# EAGLE schematic urdevboard (EAGLE 5.06), part 2 of 2
## Sheet 16 of 16
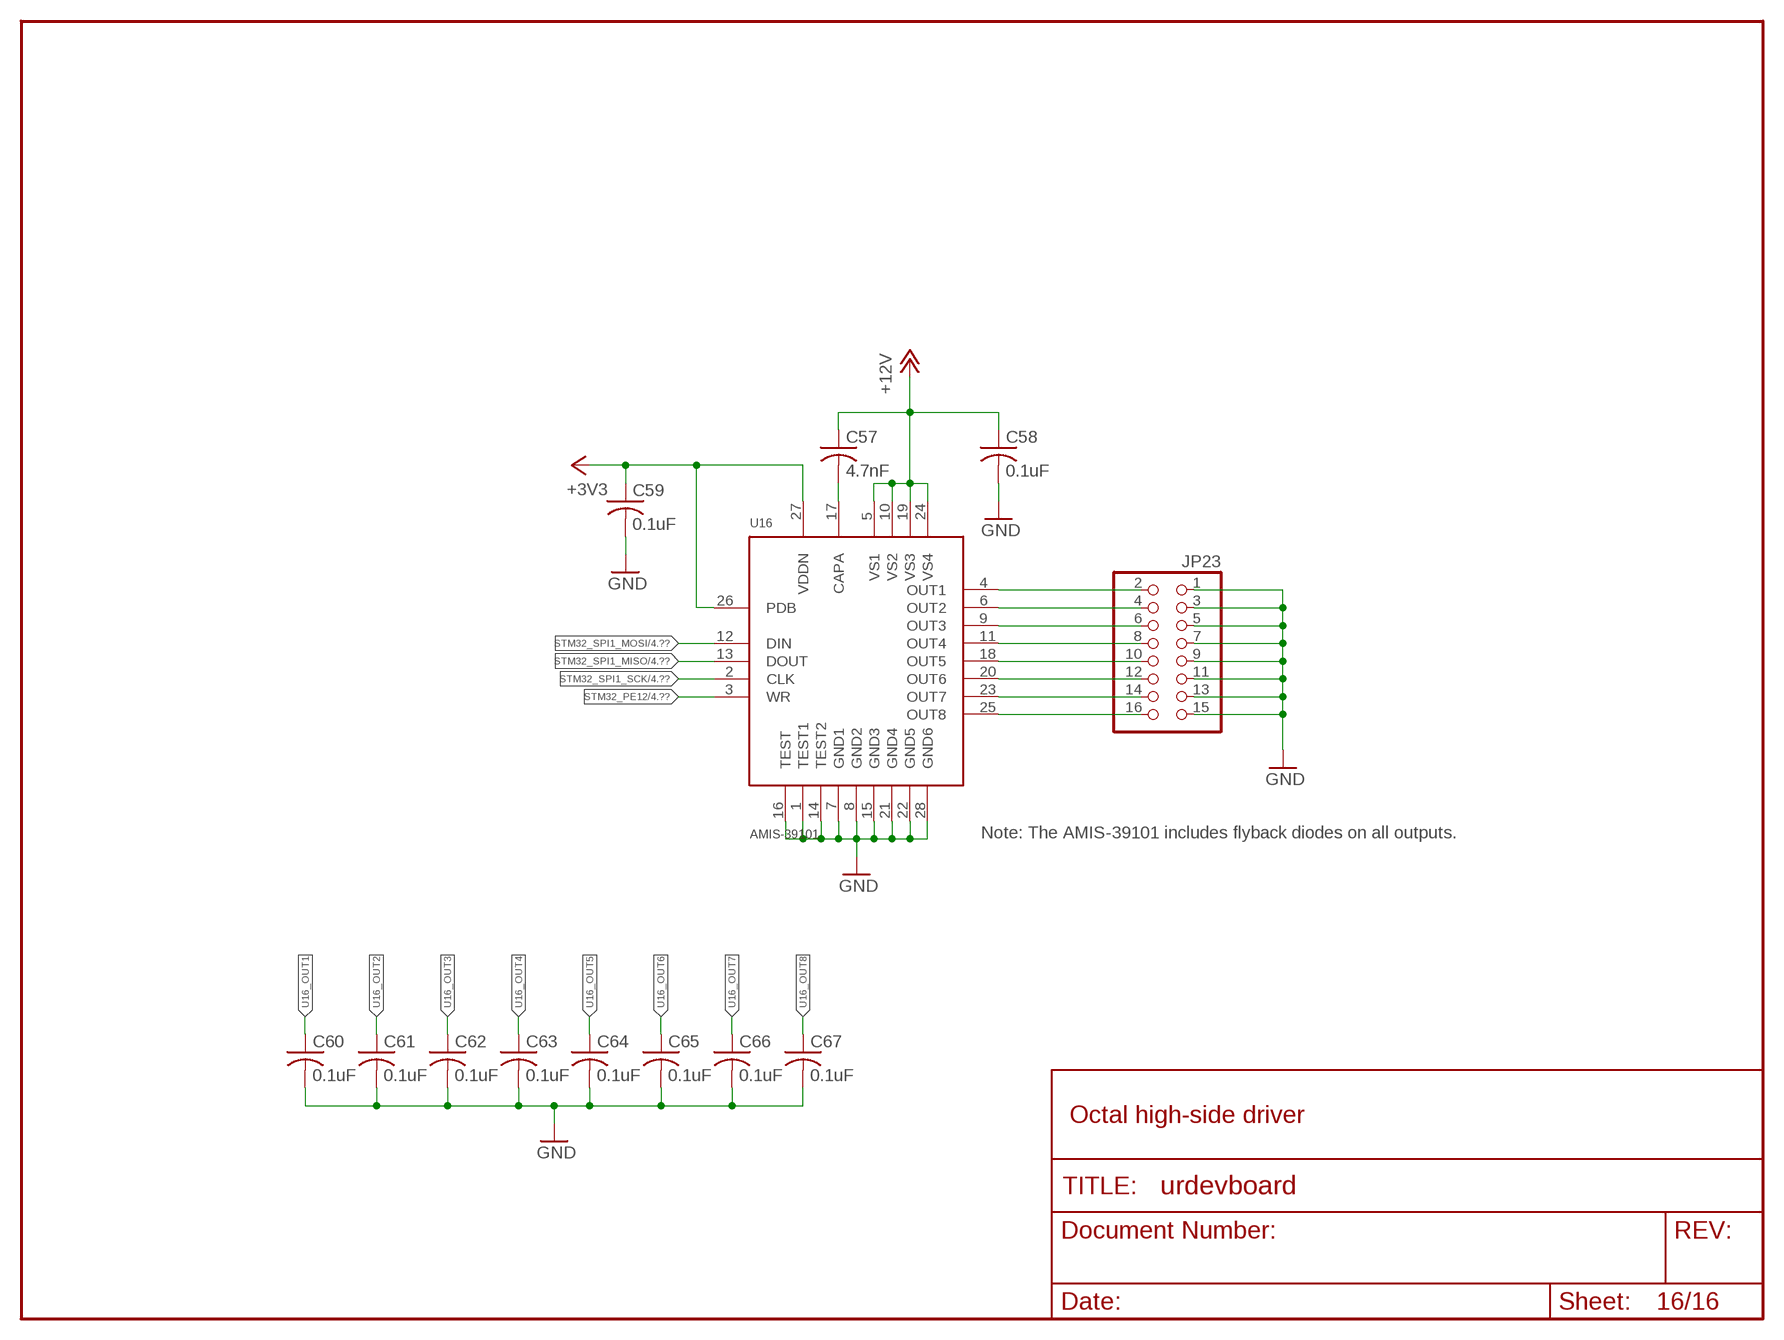
[diagram p15: schematic, sheet 16]

### Parts
C57  4.7nF  C-USC0402  [C0402]
C58  0.1uF  C-USC0402  [C0402]
C59  0.1uF  C-USC0402  [C0402]
C60  0.1uF  C-USC0402  [C0402]
C61  0.1uF  C-USC0402  [C0402]
C62  0.1uF  C-USC0402  [C0402]
C63  0.1uF  C-USC0402  [C0402]
C64  0.1uF  C-USC0402  [C0402]
C65  0.1uF  C-USC0402  [C0402]
C66  0.1uF  C-USC0402  [C0402]
C67  0.1uF  C-USC0402  [C0402]
JP23  PINHD-2X8  [2X08]
U16  AMIS-39101  [SO-28W]

### Nets
+3V3: C59.1 U16.26(PDB) U16.27(VDDN) ; also sheet 1,2,3,4,5,6,7,8,9,10,11
+12V: C57.1 C58.1 U16.5(VS1) U16.10(VS2) U16.19(VS3) U16.24(VS4) ; also sheet 7,8,13,14,15
GND: C58.2 C59.2 C60.2 C61.2 C62.2 C63.2 C64.2 C65.2 C66.2 C67.2 JP23.1 JP23.3 JP23.5 JP23.7 JP23.9 JP23.11 JP23.13 JP23.15 U16.1(TEST1) U16.7(GND1) U16.8(GND2) U16.14(TEST2) U16.15(GND3) U16.16(TEST) U16.21(GND4) U16.22(GND5) U16.28(GND6) ; also sheet 1,2,3,4,5,6,7,8,9,10,11,12,13,14,15
STM32_PE12: U16.3(WR) ; also sheet 4
STM32_SPI1_MISO: U16.13(DOUT) ; also sheet 4
STM32_SPI1_MOSI: U16.12(DIN) ; also sheet 4
STM32_SPI1_SCK: U16.2(CLK) ; also sheet 4
U16_CAPA: C57.2 U16.17(CAPA)
U16_OUT1: C60.1 JP23.2 U16.4(OUT1)
U16_OUT2: C61.1 JP23.4 U16.6(OUT2)
U16_OUT3: C62.1 JP23.6 U16.9(OUT3)
U16_OUT4: C63.1 JP23.8 U16.11(OUT4)
U16_OUT5: C64.1 JP23.10 U16.18(OUT5)
U16_OUT6: C65.1 JP23.12 U16.20(OUT6)
U16_OUT7: C66.1 JP23.14 U16.23(OUT7)
U16_OUT8: C67.1 JP23.16 U16.25(OUT8)

### Notes on the sheet
- Note: The AMIS-39101 includes flyback diodes on all outputs.
- Octal high-side driver

## Power pins joined to a net without a drawn wire
VDD: U3.6(VLCD:VDD)

## Library data of the parts
BAT1 = battery:CBC3: Intelligent Thin Film Battery With integrated power management
C1-C14 C17-C31 C33 C35 C36 C38-C43 C45-C49 C54-C118 = rcl:C-US: CAPACITOR, American symbol
C15 C16 C34 C50-C53 = SparkFun:CAP: Capacitor Standard 0603 ceramic capacitor, and 0.1" leaded capacitor.
C32 C37 C44 = rcl:CPOL-US: POLARIZED CAPACITOR, American symbol
D1-D24 D26-D35 = diode:SCHOTTKY-DIODE: Schottky Diode
D25 = diode:SCHOTTKY-3: Schottky Diode
D36 = diode:DIODE_SCHOTTKY2-: Schottky Bidirectional Diode
F1-F3 = SparkFun:PTC: Resettable Fuse PTC Resettable Fuse. Spark Fun Electronics SKU : COM-08357
IC1 IC2 = st-microelectronics:VNH2SP30: FULLY INTEGRATED H-BRIDGE MOTOR DRIVER Source: http://pdf1.alldatasheet.com/datasheet-pdf/view/84563/STMICROELECTRONICS/VNH2SP30.html
IC3 = SparkFun:L298: L298 Dual Full Bridge Driver
IC4 IC5 = 74xx-little-us:74*1G3157: Single-Pole, Double-Throw Analog Switch Source: http://focus.ti.com/lit/ds/symlink/sn74lvc1g3157.pdf
IC6 = microchip:93-*: Serial EEPROM 512 x 8 bit/256 x 16 bit/1 K/4 K, 5.0 V, Microwire
IC7 = 74xx-us:74*164: 8-bit parallel out SHIFT REGISTER
IC8 = on-semiconductor:LV8549M: 12V Stepper Motor Driver Source: http://www.onsemi.com/pub_link/Collateral/LV8549M-D.PDF Author: jbaker0428@gmail.com
IC9 = 74xx-little-us:74*2G17: Low-power dual Schmitt trigger
J1 = con-amphenol:ESPM02200
J2-J5 = con-tyco:796689-2: TERMINAL BLOCK 5 mm, Euro Style
J6 = con-sullinselectronics:RJ45: RJ-45 Connector
JARD = SparkFun:ARDUINO_SHIELD
JP1 = pinhead:PINHD-2X10: PIN HEADER
JP2 = pinhead:PINHD-2X11: PIN HEADER
JP3-JP5 = pinhead:PINHD-2X6: PIN HEADER
JP6-JP12 JP14-JP20 = SparkFun:M03: Header 3 Standard 3-pin 0.1" header. Use with straight break away headers (SKU : PRT-00116), right angle break away headers (PRT-00553), swiss pins (PRT-00743), machine pins (PRT-00117), and female headers (PRT-00115). Molex polarized connector foot print use with SKU : PRT-08232 with associated crimp pins and housings.
JP13 = SparkFun:M05X2: Header 5x2 Standard 10-pin dual row 0.1" header. Commonly used with AVR-ISP. Use with Spark Fun Electronics SKU: PRT-00778
JP21 = SparkFun:M02: Header 2 Standard 2-pin 0.1" header. Use with straight break away headers (SKU : PRT-00116), right angle break away headers (PRT-00553), swiss pins (PRT-00743), machine pins (PRT-00117), and female headers (PRT-00115). Molex polarized connector foot print use with SKU : PRT-08233 with associated crimp pins and housings.
JP22 = pinhead:PINHD-2X5: PIN HEADER
JP23 = pinhead:PINHD-2X8: PIN HEADER
JP24-JP27 = SparkFun:M05: Header 5 Standard 5-pin 0.1" header. Use with straight break away headers (SKU : PRT-00116), right angle break away headers (PRT-00553), swiss pins (PRT-00743), machine pins (PRT-00117), and female headers (PRT-00115). Molex polarized connector foot print use with SKU : PRT-08230 with associated crimp pins and housings.
JP28 = SparkFun:M04: Header 4 Standard 4-pin 0.1" header. Use with straight break away headers (SKU : PRT-00116), right angle break away headers (PRT-00553), swiss pins (PRT-00743), machine pins (PRT-00117), and female headers (PRT-00115). Molex polarized connector foot print use with SKU : PRT-08231 with associated crimp pins and housings. 1MM SMD Version SKU: PRT-10208
JP29-JP31 = SparkFun:FIDUCIAL: Fiducial Alignment Points Various fiducial points for machine vision alignment.
L1-L4 = rcl:L-US: INDUCTOR, American symbol
L5 = wuerth-elektronik:WE-CBF: SMD EMI Suppression Ferrite Beads - excellent anti-EMI properties - low DCR - impedances till 3000 ohms - rated current up to 6 A
LED1-LED8 = led:LED: LED OSRAM: - CHIPLED LG R971, LG N971, LY N971, LG Q971, LY Q971, LO R971, LY R971 LH N974, LH R974 LS Q976, LO Q976, LY Q976 LO Q996 - Hyper CHIPLED LW Q18S LB Q993, LB Q99A, LB R99A - SideLED LS A670, LO A670, LY A670, LG A670, LP A670 LB A673, LV A673, LT A673, LW A673 LH A674 LY A675 LS A676, LA A676, LO A676, LY A676, LW A676 LS A679, LY A679, LG A679 - Hyper Micro SIDELED® LS Y876, LA Y876, LO Y876, LY Y876 LT Y87S - SmartLED LW L88C, LW L88S LB L89C, LB L89S, LG L890 LS L89K, LO L89K, LY L89K LS L896, LA L896, LO L896, LY L896 - TOPLED LS T670, LO T670, LY T670, LG T670, LP T670 LSG T670, LSP T670, LSY T670, LOP T670, LYG T670 LG T671, LOG T671, LSG T671 LB T673, LV T673, LT T673, LW T673 LH T674 LS T676, LA T676, LO T676, LY T676, LB T676, LH T676, LSB T676, LW T676 LB T67C, LV T67C, LT T67C, LS T67K, LO T67K, LY T67K, LW E67C LS E67B, LA E67B, LO E67B, LY E67B, LB E67C, LV E67C, LT E67C LW T67C LS T679, LY T679, LG T679 LS T770, LO T770, LY T770, LG T770, LP T770 LB T773, LV T773, LT T773, LW T773 LH T774 LS E675, LA E675, LY E675, LS T675 LS T776, LA T776, LO T776, LY T776, LB T776 LHGB T686 LT T68C, LB T68C - Hyper Mini TOPLED® LB M676 - Mini TOPLED Santana® LG M470 LS M47K, LO M47K, LY M47K Source: http://www.osram.convergy.de LUXEON: - LUMILED® LXK2-PW12-R00, LXK2-PW12-S00, LXK2-PW14-U00, LXK2-PW14-V00 LXK2-PM12-R00, LXK2-PM12-S00, LXK2-PM14-U00 LXK2-PE12-Q00, LXK2-PE12-R00, LXK2-PE12-S00, LXK2-PE14-T00, LXK2-PE14-U00 LXK2-PB12-K00, LXK2-PB12-L00, LXK2-PB12-M00, LXK2-PB14-N00, LXK2-PB14-P00, LXK2-PB14-Q00 LXK2-PR12-L00, LXK2-PR12-M00, LXK2-PR14-Q00, LXK2-PR14-R00 LXK2-PD12-Q00, LXK2-PD12-R00, LXK2-PD12-S00 LXK2-PH12-R00, LXK2-PH12-S00 LXK2-PL12-P00, LXK2-PL12-Q00, LXK2-PL12-R00 Source: www.luxeon.com KINGBRIGHT: KA-3528ASYC Source: www.kingbright.com
Q1-Q3 Q15 = SparkFun:MOSFET-NCHANNEL
Q16 = SparkFun:MOSFET-PCHANNEL
R1-R97 R100-R118 R139-R150 = rcl:R-US_: RESISTOR, American symbol
U1 U2 = XMOS:XS1-L2-SPLIT
U3 = st-microelectronics:STM32L15XVX: Ultra low power ARM-based 32-bit MCU Up to 128 KB Flash, TC, LCD, USB, USART, I2C, SPI, timers, ADC, DAC, comparators TQFP-100
U4 = microchip:25*: Serial EEPROM 4 K, SPI bus
U5 = SparkFun:NCP303LSN09
U6 = SparkFun:NC7WZ07
U7 = SparkFun:MC34063
U8 = texas:TPS54620: 4.5V to 17V Input, 6A Synchronous Step Down SWIFT? Converter Source: http://www.ti.com/lit/ds/slvs949c/slvs949c.pdf
U9 = fairchild-semic:FAN2012: 1.5A Low Voltage Current Mode Synchronous PWM Buck Regulator
U10 = texas:TPS5431: 3-A,WIDE INPUT RANGE,STEP-DOWN SWIFT CONVERTER
U11 = texas:TXS0102: 2-BIT BIDIRECTIONAL VOLTAGE-LEVEL TRANSLATOR FOR OPEN-DRAIN APPLICATIONS
U12 U19-U22 = texas:TXB0108: 8-BIT BIDIRECTIONAL VOLTAGE-LEVEL TRANSLATOR WITH AUTO-DIRECTION SENSING AND ±15-k VESD PROTECTION
U13 = SparkFun:HMC5883L: 3 Axis Digital Compass IC
U14 = freescale:MMA845XQ: 3-Axis, 12-bit/8-bit Digital Accelerometer
U15 = SparkFun:L3G4200D: L3G4200D Three-axis, digital output gyroscope The L3G4200D is a low-power three-axis angular rate sensor, has a full scale of ±250/±500/±2000 dps and is capable of measuring rates with a user-selectable bandwidth. It includes a sensing element and an IC interface capable of providing the measured angular rate to the external world through a digital interface (I2C/SPI). Package: 4x4x1.1 LGA-16 (LGA16-4x4.PAC)
U16 = on-semiconductor:AMIS-39101
U17 = texas:CDCLVC1103: 3.3V and 2.5V LVCMOS 1:3 Clock Buffer
U18 = ftdi-jt:FT2232D: FTDI FT2232D dual USB UART
U23 = st-microelectronics:STM32F10XCXT6: ST STM32F101/103 48pin LQFP
U24 = microchip:ENC28J60: Stand-Alone Ethernet Controller with SPI Interface Source: http://ww1.microchip.com/downloads/en/DeviceDoc/39662c.pdf
X1 X4 X5 = con-hirose:MINI-USB-: MINI USB Connector Source: http://www.hirose.co.jp/cataloge_hp/e24000019.pdf
X2 = SparkFun:USD-SOCKET: microSD Socket Push-push type uSD socket. Schematic element and footprint production proven. Spark Fun Electronics SKU : PRT-00127. tDoc lines correctly indicate media card edge positions when inserting (unlocked, locked, depressed).
X3 = SparkFun:XBEE-1
Y1 = crystal:ASF*: CRYSTAL CLOCK OSCILLATORS 5.0 Vdc or 3.3 Vdc - LOW PROFILE ULTRA MINIATURE CERAMIC SURFACE MOUNT Source: http://www.abracon.com/Oscillators/asf1-L-L1.pdf
Y2 = murata-filter:CSTCR: Resonator Source: murata.co.jp